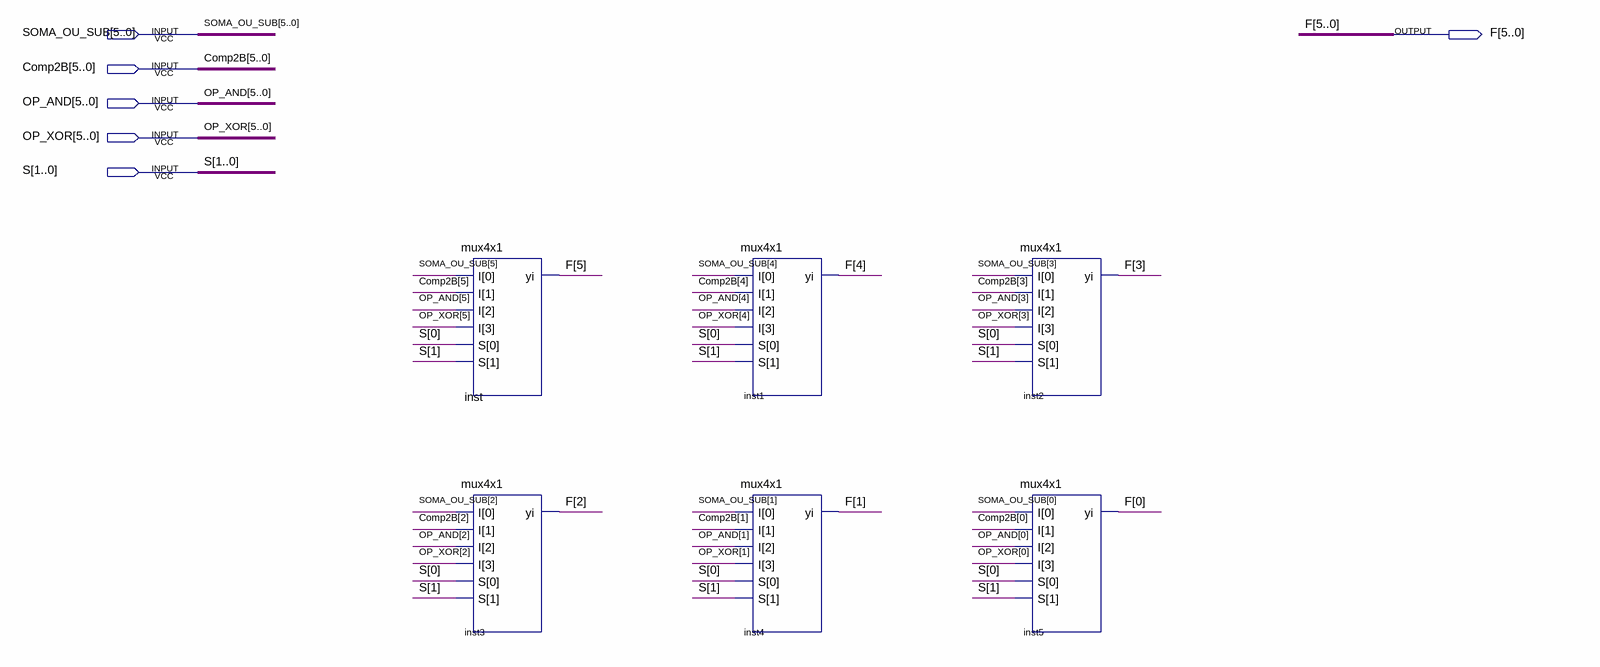
[diagram p0: schematic sheet]
// Quartus schematic mux_saida.bdf as structural Verilog: 6 symbols, 6 pins
module mux_saida (
  input  [5:0] SOMA_OU_SUB,
  input  [5:0] Comp2B,
  input  [5:0] OP_AND,
  input  [5:0] OP_XOR,
  input  [1:0] S,
  output [5:0] F
);

  mux4x1 inst (.I({OP_XOR[5], OP_AND[5], Comp2B[5], SOMA_OU_SUB[5]}), .S(S), .yi(F[5]));
  mux4x1 inst3 (.I({OP_XOR[2], OP_AND[2], Comp2B[2], SOMA_OU_SUB[2]}), .S(S), .yi(F[2]));
  mux4x1 inst1 (.I({OP_XOR[4], OP_AND[4], Comp2B[4], SOMA_OU_SUB[4]}), .S(S), .yi(F[4]));
  mux4x1 inst4 (.I({OP_XOR[1], OP_AND[1], Comp2B[1], SOMA_OU_SUB[1]}), .S(S), .yi(F[1]));
  mux4x1 inst2 (.I({OP_XOR[3], OP_AND[3], Comp2B[3], SOMA_OU_SUB[3]}), .S(S), .yi(F[3]));
  mux4x1 inst5 (.I({OP_XOR[0], OP_AND[0], Comp2B[0], SOMA_OU_SUB[0]}), .S(S), .yi(F[0]));
endmodule
